# Altium schematic sheet ti-tmds62levm-rev-b-sheet-17.SchDoc
size 513 x 386 mm
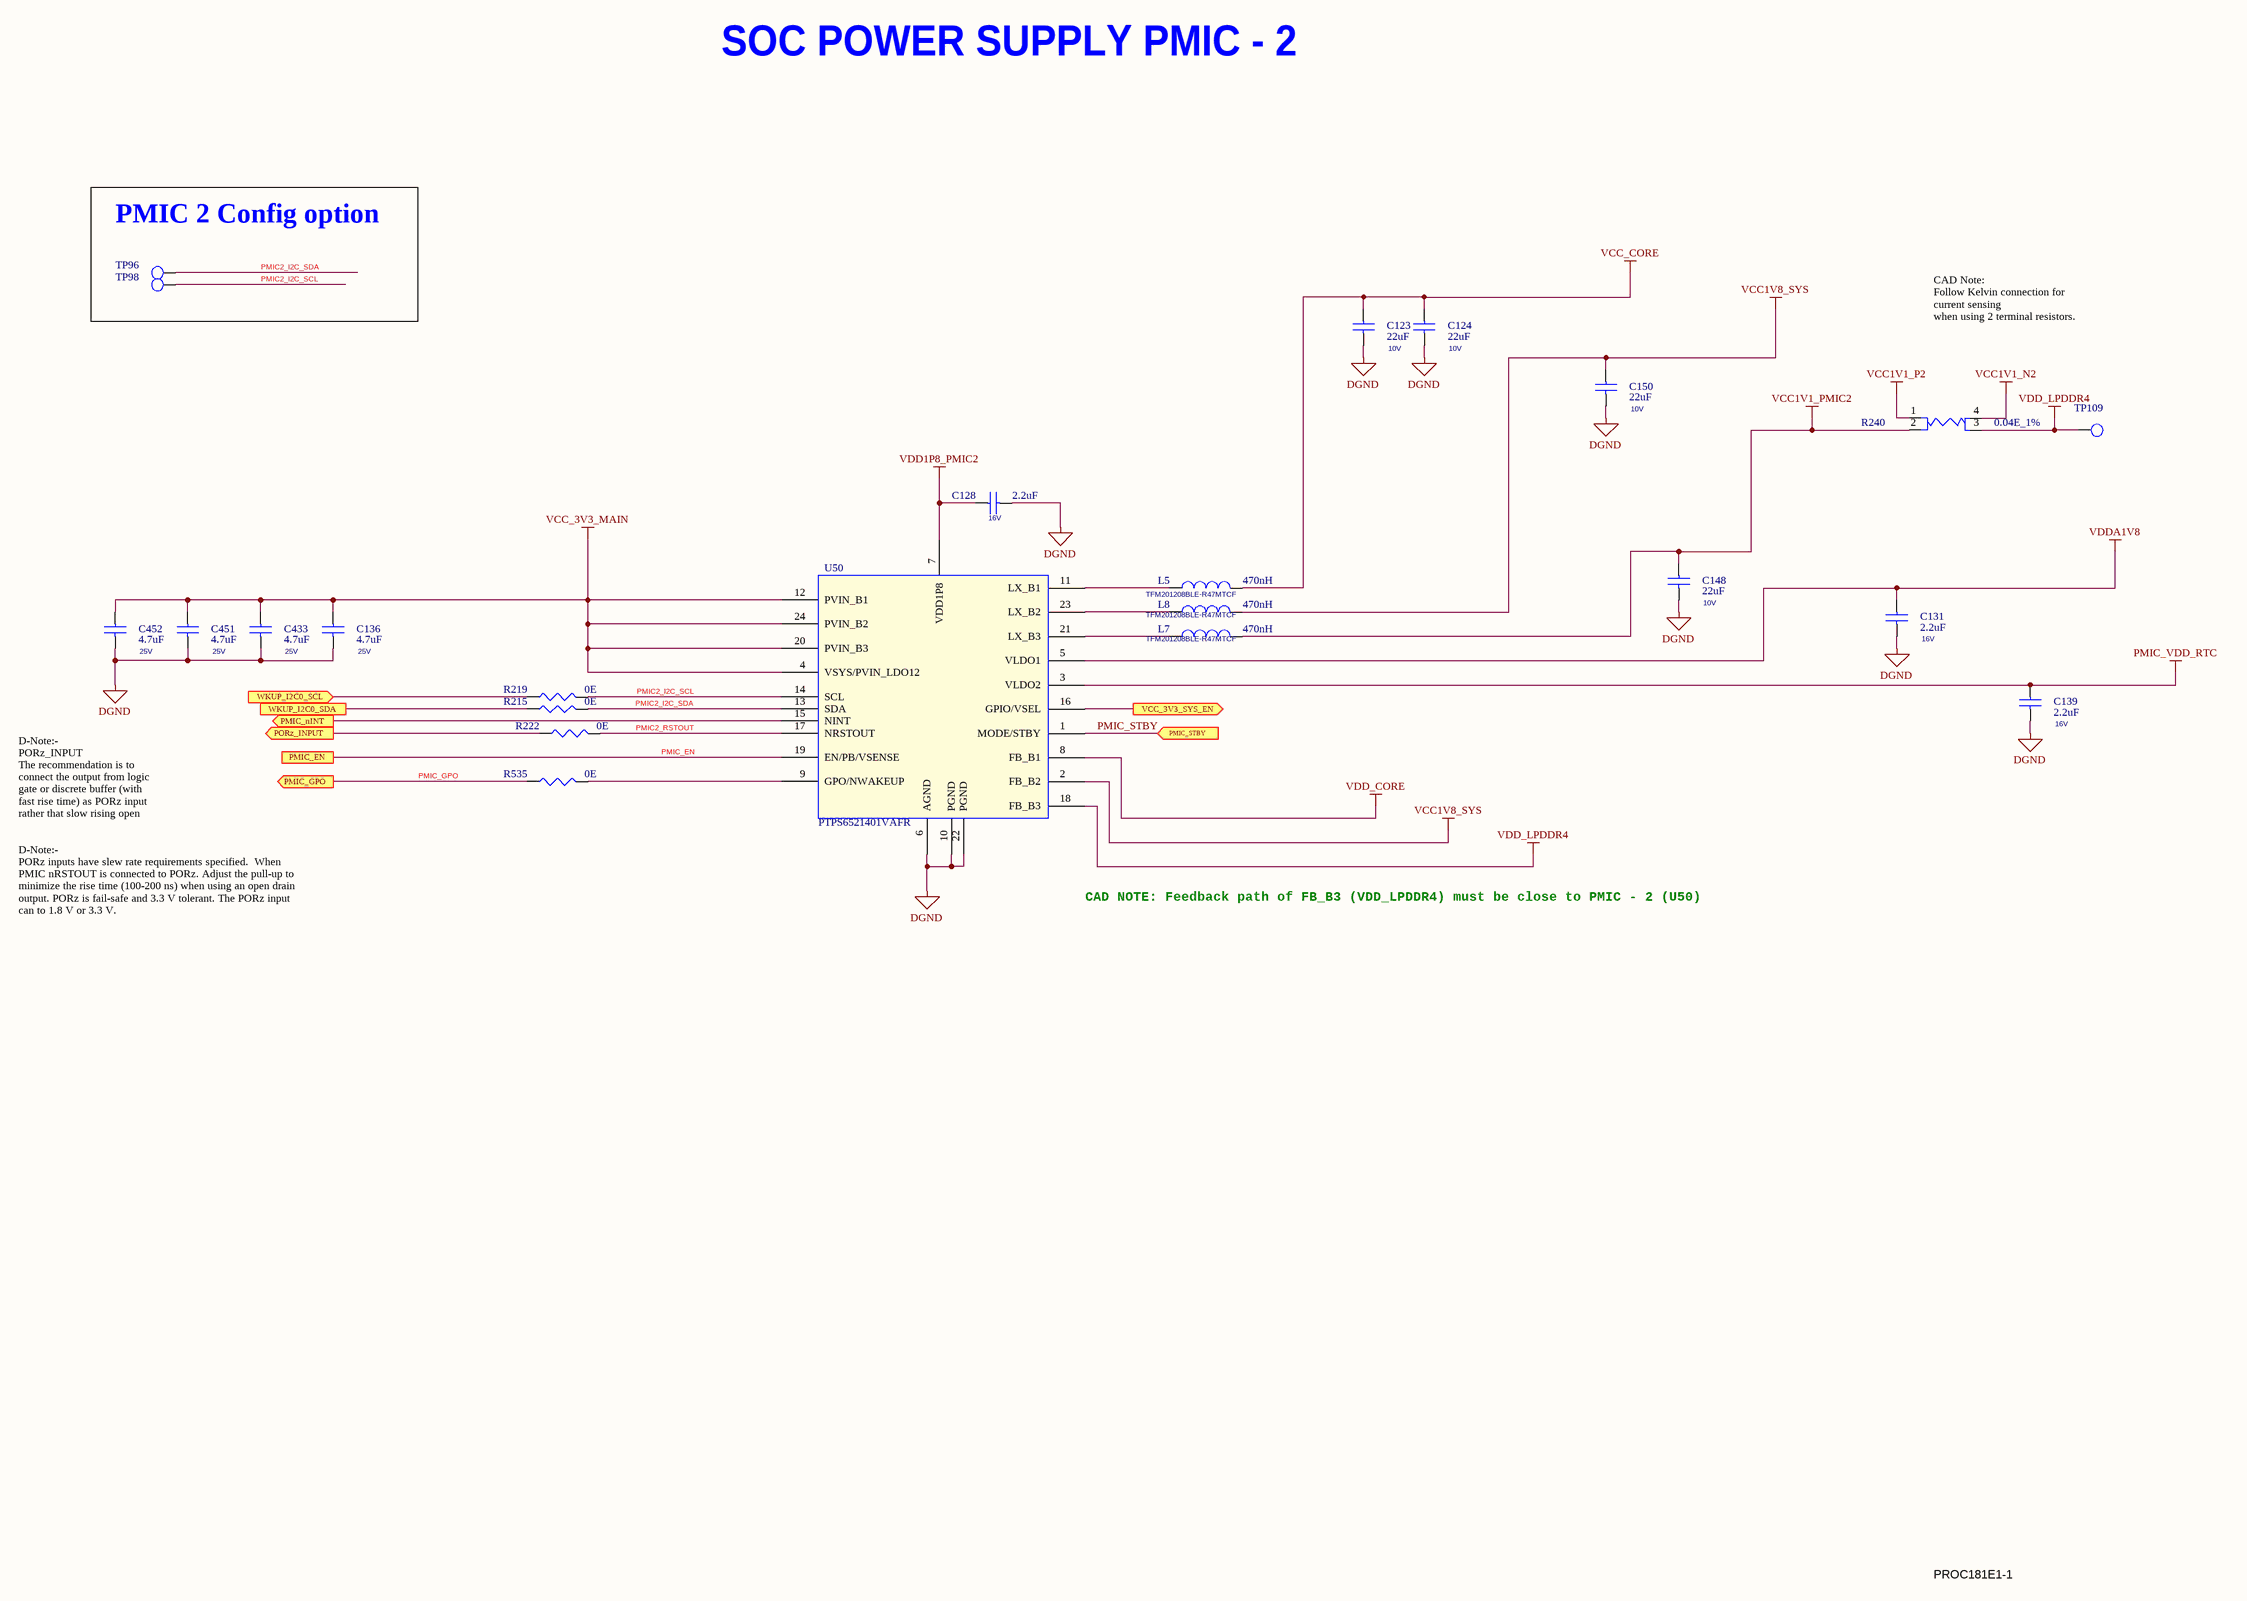
[diagram p0: ti-tmds62levm-rev-b-sheet-17.SchDoc]

## Parts
C123  22uF  Voltage: 10V  [CAP0805_1-5]
C124  22uF  Voltage: 10V  [CAP0805_1-5]
C128  2.2uF  Voltage: 16V  [CAP0402_0-75]
C131  2.2uF  Voltage: 16V  [CAP0402_0-75]
C136  4.7uF  Voltage: 25V  [CAP0603_1]
C139  2.2uF  Voltage: 16V  [CAP0402_0-75]
C148  22uF  Voltage: 10V  [CAP0805_1-5]
C150  22uF  Voltage: 10V  [CAP0805_1-5]
C433  4.7uF  Voltage: 25V  [CAP0603_1]
C451  4.7uF  Voltage: 25V  [CAP0603_1]
C452  4.7uF  Voltage: 25V  [CAP0603_1]
L5  470nH  Mfr_part_number: TFM201208BLE-R47MTCF  [IND_0805HT_90X60_SMD]
L7  470nH  Mfr_part_number: TFM201208BLE-R47MTCF  [IND_0805HT_90X60_SMD]
L8  470nH  Mfr_part_number: TFM201208BLE-R47MTCF  [IND_0805HT_90X60_SMD]
R215  0E  [RES0201_0-5]
R219  0E  [RES0201_0-5]
R222  0E  [RES0201_0-5]
R240  0.04E_1%  [RES_FC4T_1206-4_1]
R535  0E  [RES0201_0-5]
TP96  TP30_SMD  [TP30_SMD]  (value not drawn)
TP98  TP30_SMD  [TP30_SMD]  (value not drawn)
TP109  TP40_SMD  [TP40_SMD]  (value not drawn)
U50  PTPS6521401VAFR  [WQFN24_PTPS6521401VAFR_140X140_0-8]

## Blocks framed on the sheet
PMIC 2 Config option: TP96 TP98

## Ports
PMIC_EN (see 14[6C], 15[2B]), PMIC_GPO (out, see 14[5C], 15[2B], 15[4D]), PMIC_nINT (out, see 15[2B], 21[4B]), PMIC_STBY (in, see 14[5D], 15[4B]), PORz_INPUT (out, see 13[4D], 14[2D], 15[2B], 21[2A], 44[3C], 54[2B]), VCC_3V3_SYS_EN (out, see 15[2B], 17[2D]), WKUP_I2C0_SCL (in, see 15[2B], 20[2A]), WKUP_I2C0_SDA (see 15[2B], 20[2A])

## Nets
DGND: C123.2 C124.2 C128.2 C131.2 C136.2 C139.2 C148.2 C150.2 C433.2 C451.2 C452.2 U50.6(AGND) U50.10(PGND) U50.22(PGND)
PMIC_VDD_RTC: C139.1 U50.3(VLDO2)
VCC1V1_N2: R240.4
VCC1V1_P2: R240.1
VCC1V1_PMIC2: C148.1 L7.2 R240.2
VCC1V8_SYS: C150.1 L8.2 U50.2(FB_B2)
VCC_3V3_MAIN: C136.1 C433.1 C451.1 C452.1 U50.4(VSYS/PVIN_LDO12) U50.12(PVIN_B1) U50.20(PVIN_B3) U50.24(PVIN_B2)
VCC_CORE: C123.1 C124.1 L5.2
VDD1P8_PMIC2: C128.1 U50.7(VDD1P8)
VDD_CORE: U50.8(FB_B1)
VDD_LPDDR4: R240.3 TP109.1(TP) U50.18(FB_B3)
VDDA1V8: C131.1 U50.5(VLDO1)
PMIC2_I2C_SCL: R219.2 TP98.1(TP) U50.14(SCL)
PMIC2_I2C_SDA: R215.2 TP96.1(TP) U50.13(SDA)
PMIC2_RSTOUT: R222.2 U50.17(NRSTOUT)
PMIC_EN: U50.19(EN/PB/VSENSE) ; port PMIC_EN
PMIC_GPO: R535.1 ; port PMIC_GPO
PMIC_nINT: U50.15(NINT) ; port PMIC_nINT
PMIC_STBY: U50.1(MODE/STBY) ; port PMIC_STBY
PORz_INPUT: R222.1 ; port PORz_INPUT
VCC_3V3_SYS_EN: U50.16(GPIO/VSEL) ; port VCC_3V3_SYS_EN
WKUP_I2C0_SCL: R219.1 ; port WKUP_I2C0_SCL
WKUP_I2C0_SDA: R215.1 ; port WKUP_I2C0_SDA
NetL5_1: L5.1 U50.11(LX_B1)
NetL7_1: L7.1 U50.21(LX_B3)
NetL8_1: L8.1 U50.23(LX_B2)
NetR535_2: R535.2 U50.9(GPO/NWAKEUP)

## Notes on the sheet
- SOC POWER SUPPLY PMIC - 2
- CAD Note:
  Follow Kelvin connection for current sensing
  when using 2 terminal resistors.
- Text
- D-Note:-
  PORz_INPUT
  The recommendation is to connect the output from logic gate or discrete buffer (with fast rise time) as PORz input rather that slow rising open drain
  output.
- D-Note:-
  PORz inputs have slew rate requirements specified.  When PMIC nRSTOUT is connected to PORz. Adjust the pull-up to minimize the rise time (100-200 ns) when using an open drain output. PORz is fail-safe and 3.3 V tolerant. The PORz input can to 1.8 V or 3.3 V.
- CAD NOTE: Feedback path of FB_B3 (VDD_LPDDR4) must be close to PMIC - 2 (U50)
- PROC181E1-1

## Library data of the parts
C123 = CAP_Dup1: CAP CERAMIC 22uF 10V 20% X7R 0805; Part_type: CAPACITORS\CERAMIC; Mfr_part_number: GRM21BZ71A226ME15L; Mfr_name: MURATA; Mistral Part No: 120024060041-R; Custom_Duty: 15%; Customs_HS_Code: 85322990; Wattage: NA; Project: AM62L_EVM; Footprint Path: Y:\MIS_DATABASE\Library\ALTIUM_TOOL\PCB_FOOTPRINTS\Altium_Footprint_Lib.PcbLib; Library Path: Y:\MIS_DATABASE\Library\ALTIUM_TOOL\SCHEMATICS_PARTS\MS_DISCRETE_Library.schlib; MECHANICAL 3D STEP FILE: CAP0805_1-5; Chkd/date: PRADEEP/260624; Crtd /date: SHANKARI/260624; Datasheet: Y:\MIS_DATABASE\DATASHEETS\CAPACITORS\GRM21BZ71A226ME15L.PDF; Temperature: -55°C+125°C; Weight: 1.6mg; Height: 1.45MM; Library Ref: CAP; Distributor_part_number: 490-GRM21BZ71A226ME15LCT-ND; Distributor_name: DIGIKEY; Package: 0805; Tolerance: 20%; Footprint Ref: CAP0805_1-5; PCB Footprint: CAP0805_1-5
C124 C148 C150 = CAP_Dup1: CAP CERAMIC 22uF 10V 20% X7R 0805; Mistral Part No: 120024060041-R; Mfr_name: MURATA; Mfr_part_number: GRM21BZ71A226ME15L; Part_type: CAPACITORS\CERAMIC; Project: AM62L_EVM; Wattage: NA; Customs_HS_Code: 85322990; Custom_Duty: 15%; Footprint Ref: CAP0805_1-5; Tolerance: 20%; Package: 0805; Distributor_name: DIGIKEY; Distributor_part_number: 490-GRM21BZ71A226ME15LCT-ND; Library Ref: CAP; Height: 1.45MM; Weight: 1.6mg; Temperature: -55°C+125°C; Datasheet: Y:\MIS_DATABASE\DATASHEETS\CAPACITORS\GRM21BZ71A226ME15L.PDF; Crtd /date: SHANKARI/260624; Chkd/date: PRADEEP/260624; MECHANICAL 3D STEP FILE: CAP0805_1-5; Library Path: Y:\MIS_DATABASE\Library\ALTIUM_TOOL\SCHEMATICS_PARTS\MS_DISCRETE_Library.schlib; Footprint Path: Y:\MIS_DATABASE\Library\ALTIUM_TOOL\PCB_FOOTPRINTS\Altium_Footprint_Lib.PcbLib; PCB Footprint: CAP0805_1-5
C128 C131 C139 = CAP_Dup1: CAP CERAMIC 2.2uF 16V 10% X6S 0402; Part_type: CAPACITORS\CERAMIC; Mfr_part_number: GRM155C81C225KE11D; Mfr_name: MURATA; Mistral Part No: 120024070001-R; Custom_Duty: 15%; Customs_HS_Code: 85322990; Wattage: NA; Project: AM62L_EVM; Footprint Path: Y:\MIS_DATABASE\Library\ALTIUM_TOOL\PCB_FOOTPRINTS\Altium_Footprint_Lib.PcbLib; Library Path: Y:\MIS_DATABASE\Library\ALTIUM_TOOL\SCHEMATICS_PARTS\MS_DISCRETE_Library.schlib; MECHANICAL 3D STEP FILE: CAP0402_0-75; Chkd/date: PRADEEP/010724; Crtd /date: SHANKARI/010724; Datasheet: Y:\MIS_DATABASE\DATASHEETS\CAPACITORS\GRM155C81C225KE11D.PDF; Temperature: -55°C+105°C; Weight: NA; Height: 0.55MM; Library Ref: CAP; Distributor_part_number: 490-14595-1-ND; Distributor_name: DIGIKEY; Package: 0402; Tolerance: 10%; Footprint Ref: CAP0402_0-75; PCB Footprint: CAP0402_0-75
C136 C452 = CAP_Dup1: CAP CERAMIC 4.7uF 25V 10% X6S 0603; Part_type: CAPACITORS\CERAMIC; Mfr_part_number: GRM188C81E475KE11D; Mfr_name: MURATA; Mistral Part No: 120018100056-R; Custom_Duty: 15%; Customs_HS_Code: 85322990; Wattage: NA; Project: TI_J7ES_EVM_CP; Footprint Path: Y:\MIS_DATABASE\Library\ALTIUM_TOOL\PCB_FOOTPRINTS\Altium_Footprint_Lib.PcbLib; Library Path: Y:\MIS_DATABASE\Library\ALTIUM_TOOL\SCHEMATICS_PARTS\MS_DISCRETE_Library.schlib; MECHANICAL 3D STEP FILE: CAP0603_1; Chkd/date: MANIRAJA/241018; Crtd /date: ALVY/241018; Datasheet: Y:\MIS_DATABASE\DATASHEETS\CAPACITORS\GRM188C81E475KE11D.PDF; Temperature: -55°C+105°C; Weight: 6.3mg; Height: 1.00MM; Library Ref: CAP; Distributor_part_number: 490-7199-1-ND; Distributor_name: DIGIKEY; Package: 0603; Tolerance: 10%; Footprint Ref: CAP0603_1; PCB Footprint: CAP0603_1
C433 C451 = CAP_Dup1: CAP CERAMIC 4.7uF 25V 10% X6S 0603; Mistral Part No: 120018100056-R; Mfr_name: MURATA; Mfr_part_number: GRM188C81E475KE11D; Part_type: CAPACITORS\CERAMIC; Project: TI_J7ES_EVM_CP; Wattage: NA; Customs_HS_Code: 85322990; Custom_Duty: 15%; Footprint Ref: CAP0603_1; Tolerance: 10%; Package: 0603; Distributor_name: DIGIKEY; Distributor_part_number: 490-7199-1-ND; Library Ref: CAP; Height: 1.00MM; Weight: 6.3mg; Temperature: -55°C+105°C; Datasheet: Y:\MIS_DATABASE\DATASHEETS\CAPACITORS\GRM188C81E475KE11D.PDF; Crtd /date: ALVY/241018; Chkd/date: MANIRAJA/241018; MECHANICAL 3D STEP FILE: CAP0603_1; Library Path: Y:\MIS_DATABASE\Library\ALTIUM_TOOL\SCHEMATICS_PARTS\MS_DISCRETE_Library.schlib; Footprint Path: Y:\MIS_DATABASE\Library\ALTIUM_TOOL\PCB_FOOTPRINTS\Altium_Footprint_Lib.PcbLib; PCB Footprint: CAP0603_1
L5 = INDUCTOR_Dup1: IND POWER 470nH 4A 20% 0805; Mfr_name: TDK CORPORATION; Mistral Part No: 130024060053-R; Custom_Duty: 15%; Customs_HS_Code: 85437099; Wattage: NA; Project: AM62L_EVM; Footprint Path: Y:\MIS_DATABASE\Library\ALTIUM_TOOL\PCB_FOOTPRINTS\Altium_Footprint_Lib.PcbLib; Library Path: Y:\MIS_DATABASE\Library\ALTIUM_TOOL\SCHEMATICS_PARTS\MS_DISCRETE_Library.schlib; MECHANICAL 3D STEP FILE: IND_0805HT_90X60_SMD; Chkd/date: PRADEEP/260624; Crtd /date: SHANKARI/260624; Datasheet: Y:\MIS_DATABASE\DATASHEETS\DISCRETES\INDUCTORS\TFM201208BLE.PDF; Temperature: -40°C+85°C; Weight: NA; Height: 0.80mm; Library Ref: INDUCTOR; Distributor_part_number: 445-TFM201208BLE-R47MTCFCT-ND; Distributor_name: DIGIKEY; Package: 0805; Voltage: NA; Tolerance: 20%; Part_type: INDUCTOR; Footprint Ref: IND_0805HT_90X60_SMD; PCB Footprint: IND_0805HT_90X60_SMD
L7 L8 = INDUCTOR_Dup1: IND POWER 470nH 4A 20% 0805; Mistral Part No: 130024060053-R; Mfr_name: TDK CORPORATION; Project: AM62L_EVM; Voltage: NA; Customs_HS_Code: 85437099; Custom_Duty: 15%; Footprint Ref: IND_0805HT_90X60_SMD; Part_type: INDUCTOR; Tolerance: 20%; Wattage: NA; Package: 0805; Distributor_name: DIGIKEY; Distributor_part_number: 445-TFM201208BLE-R47MTCFCT-ND; Library Ref: INDUCTOR; Height: 0.80mm; Weight: NA; Temperature: -40°C+85°C; Datasheet: Y:\MIS_DATABASE\DATASHEETS\DISCRETES\INDUCTORS\TFM201208BLE.PDF; Crtd /date: SHANKARI/260624; Chkd/date: PRADEEP/260624; MECHANICAL 3D STEP FILE: IND_0805HT_90X60_SMD; Library Path: Y:\MIS_DATABASE\Library\ALTIUM_TOOL\SCHEMATICS_PARTS\MS_DISCRETE_Library.schlib; Footprint Path: Y:\MIS_DATABASE\Library\ALTIUM_TOOL\PCB_FOOTPRINTS\Altium_Footprint_Lib.PcbLib; PCB Footprint: IND_0805HT_90X60_SMD
R215 R219 R222 R535 = RESISTOR_Dup4: RES 0E 1/20W 5% 0201; Mistral Part No: 110010070067-R; Mfr_name: YAGEO AMERICA; Mfr_part_number: RC0201JR-070RL; Part_type: RESISTORS\FIXED; Project: PB_BUGBASE; Voltage: NA; Customs_HS_Code: 85332119; Custom_Duty: 15%; MECHANICAL 3D STEP FILE: RES0201_0-5; Tolerance: 5%; Wattage: 1/20W; Package: 0201; Distributor_name: DIGIKEY; Distributor_part_number: 311-0.0NCT-ND; Height: 0.26MM; Weight: 0.17mg; Temperature: -55°C+125°C; Datasheet: Y:\MIS_DATABASE\DATASHEETS\RESISTORS\RCXXXXL-SER_MAR18.PDF; Crtd /date: MUDDU/120710; Chkd/date: NAVEED/301214; Library Ref: RESISTOR; Footprint Ref: RES0201_0-5; Library Path: Y:\MIS_DATABASE\Library\ALTIUM_TOOL\SCHEMATICS_PARTS\MS_DISCRETE_Library.schlib; Footprint Path: Y:\MIS_DATABASE\Library\ALTIUM_TOOL\PCB_FOOTPRINTS\Altium_Footprint_Lib.PcbLib; PCB Footprint: RES0201_0-5
R240 = RESISTOR-4TERM: RES CURRENT SENSE 0.04E 1/4W 1% 1206-4; Part_type: RESISTORS\FIXED; Mfr_part_number: WSK1206R0400FEA; Mfr_name: VISHAY; Mistral Part No: 110024080001-R; Custom_Duty: 15%; Customs_HS_Code: 85332119; Voltage: NA; Project: AM62L_EVM; Footprint Path: Y:\MIS_DATABASE\Library\ALTIUM_TOOL\PCB_FOOTPRINTS\Altium_Footprint_Lib.PcbLib; Library Path: Y:\MIS_DATABASE\Library\ALTIUM_TOOL\SCHEMATICS_PARTS\MS_DISCRETE_Library.schlib; MECHANICAL 3D STEP FILE: RES_FC4T_1206-4_1; Chkd/date: PRADEEP/050824; Crtd /date: SHANKARI/050824; Datasheet: Y:\MIS_DATABASE\DATASHEETS\RESISTORS\WSK1206R0400FEA.PDF; Temperature: -65°C+170°C; Weight: 16.2mg; Height: 0.88MM; Library Ref: RESISTOR-4TERM; Distributor_part_number: 541-WSK1206R0400FEACT-ND; Distributor_name: DIGIKEY; Package: 1206-4; Wattage: 1/4W; Tolerance: 1%; Footprint Ref: RES_FC4T_1206-4_1; PCB Footprint: RES_FC4T_1206-4_1
TP96 = TESTPOINT: TESTPOINT CIR 30 SMD; Mistral Part No: 130009030930; Mfr_name: LOCAL; Custom_Duty: NA; Project: BT MODULE_CSRBC04; Customs_HS_Code: NA; Footprint Ref: TP30_SMD; Mfr_part_number: TP30_SMD; Part_type: TESTPOINT; Tolerance: NA; Voltage: NA; Wattage: NA; Package: SMD; Distributor_name: NA; Distributor_part_number: NA; Library Ref: TESTPOINT; Height: NA; Weight: NA; Temperature: NA; Datasheet: NA; Crtd /date: MAZHAR/171006; Chkd/date: SHREESHAIL/171006; RoHS: NA; MECHANICAL 3D STEP FILE: NA; Library Path: Y:\MIS_DATABASE\Library\ALTIUM_TOOL\SCHEMATICS_PARTS\MS_DISCRETE_Library.schlib; Footprint Path: Y:\MIS_DATABASE\Library\ALTIUM_TOOL\PCB_FOOTPRINTS\Altium_Footprint_Lib.PcbLib; PCB Footprint: TP30_SMD
TP98 = TESTPOINT: TESTPOINT CIR 30 SMD; Mfr_name: LOCAL; Mistral Part No: 130009030930; Custom_Duty: NA; Project: BT MODULE_CSRBC04; Customs_HS_Code: NA; Footprint Path: Y:\MIS_DATABASE\Library\ALTIUM_TOOL\PCB_FOOTPRINTS\Altium_Footprint_Lib.PcbLib; Library Path: Y:\MIS_DATABASE\Library\ALTIUM_TOOL\SCHEMATICS_PARTS\MS_DISCRETE_Library.schlib; MECHANICAL 3D STEP FILE: NA; RoHS: NA; Chkd/date: SHREESHAIL/171006; Crtd /date: MAZHAR/171006; Datasheet: NA; Temperature: NA; Weight: NA; Height: NA; Library Ref: TESTPOINT; Distributor_part_number: NA; Distributor_name: NA; Package: SMD; Wattage: NA; Voltage: NA; Tolerance: NA; Part_type: TESTPOINT; Mfr_part_number: TP30_SMD; Footprint Ref: TP30_SMD; PCB Footprint: TP30_SMD
TP109 = TESTPOINT: TESTPOINT CIR 40 SMD; Mfr_name: LOCAL; Mistral Part No: 130009030933; MECHANICAL 3D STEP FILE: NA; Project: RAINIER-3; Footprint Path: Y:\MIS_DATABASE\Library\ALTIUM_TOOL\PCB_FOOTPRINTS\Altium_Footprint_Lib.PcbLib; Library Path: Y:\MIS_DATABASE\Library\ALTIUM_TOOL\SCHEMATICS_PARTS\MS_DISCRETE_Library.schlib; RoHS: NA; Chkd/date: MAZHAR/190505; Crtd /date: MAZHAR/190505; Datasheet: NA; Temperature: NA; Weight: NA; Height: NA; Library Ref: TESTPOINT; Distributor_part_number: NA; Distributor_name: NA; Package: SMD; Wattage: NA; Voltage: NA; Tolerance: NA; Part_type: TESTPOINT; Mfr_part_number: TP40_SMD; Footprint Ref: TP40_SMD; PCB Footprint: TP40_SMD
U50 = TPS65214_QFN24: IC 4 INTEGRATED POWER MANAGEMENT FOR ARM CORTEX LOW POWER PROCESSORS AND FPGAS QFN24; Part_type: ICS\POWER\MANAGEMENT; Mfr_name: TEXAS INSTRUMENTS; Mistral Part No: 142024010015-R; Custom_Duty: 15%; Customs_HS_Code: 85423100; Wattage: NA; Project: AM62L_EVM; Crtd /date: TAMILARASU/160124; Datasheet: Y:\MIS_DATABASE\DATASHEETS\ICS\POWER\TPS65214.PDF; Temperature: -55°C+150°C; Weight: NA; Height: 0.80MM; Library Ref: TPS65214_QFN24; Distributor_part_number: NA; Distributor_name: NA; Package: QFN24; Voltage: NA; Tolerance: NA; Mfr_part_number: PTPS6521401VAFR; Footprint Ref: WQFN24_PTPS6521401VAFR_140X140_0-8; PCB Footprint: WQFN24_PTPS6521401VAFR_140X140_0-8